# Altium project FMC_ADC_250M_16B_4ch_LNLS.PrjPCB (part 3 of 4)

## Sheet Clock_Distribution.SchDoc
size A3
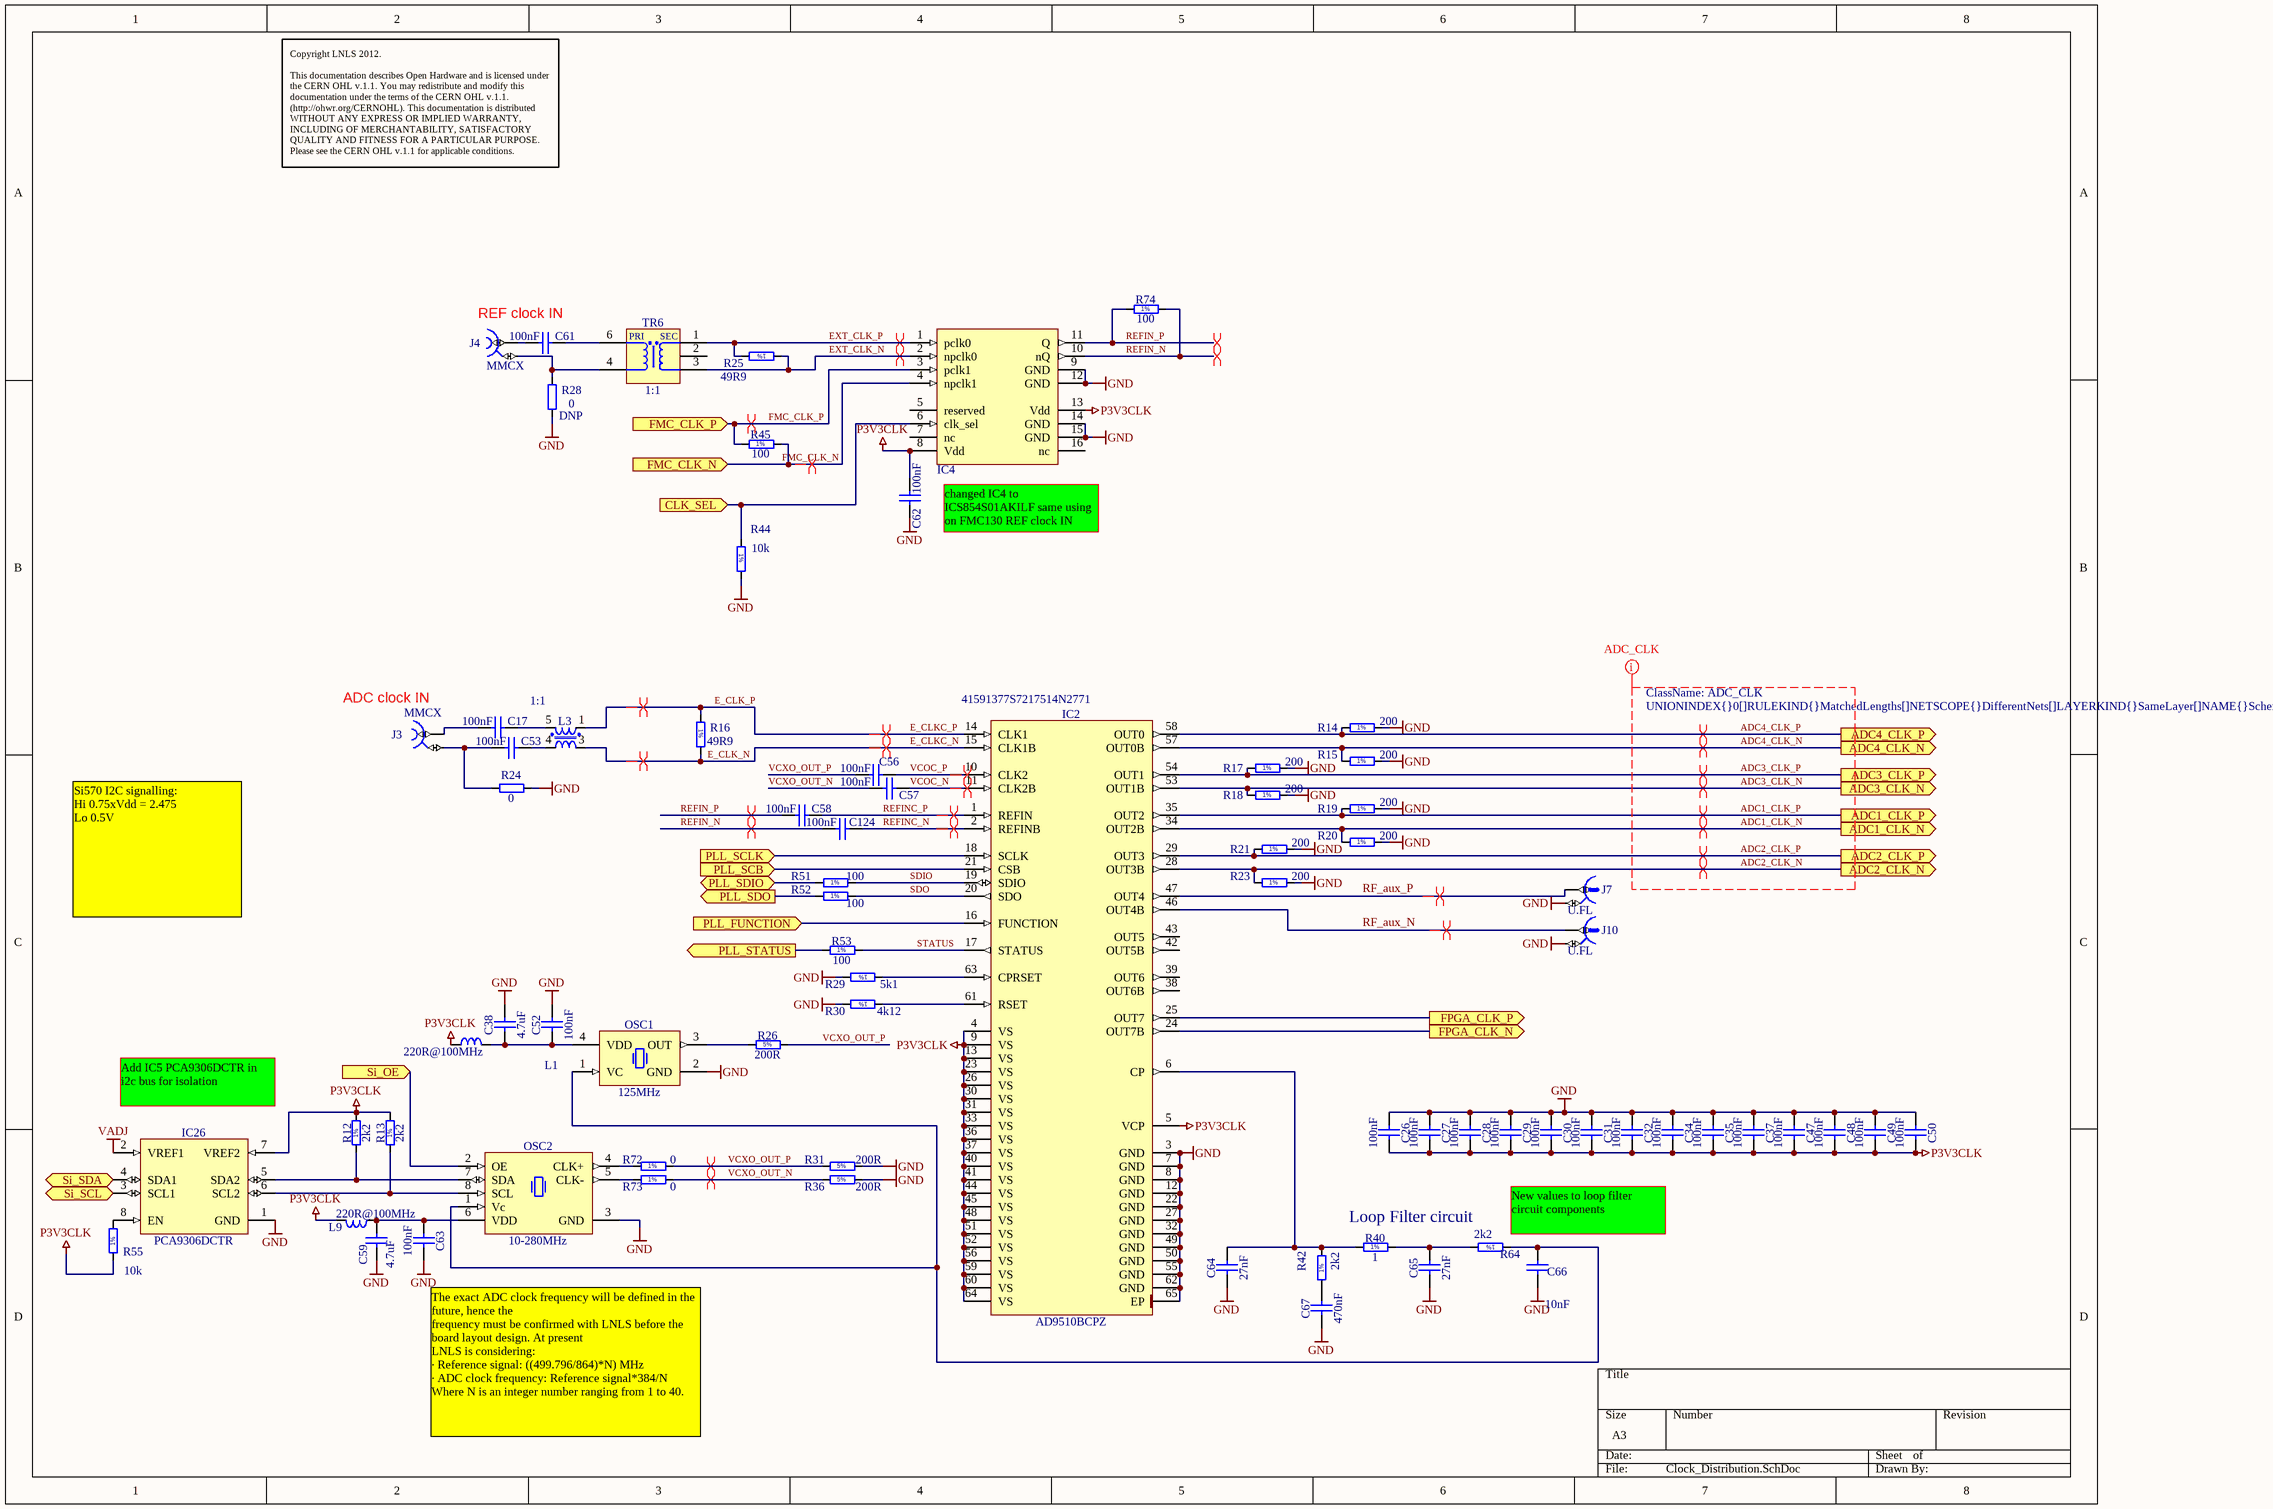
[diagram p5: Clock_Distribution.SchDoc]

### Parts
C17  100nF  [CAPC0603X33N]
C26  100nF  [CAPC0603X33N]
C27  100nF  [CAPC0603X33N]
C28  100nF  [CAPC0603X33N]
C29  100nF  [CAPC0603X33N]
C30  100nF  [CAPC0603X33N]
C31  100nF  [CAPC0603X33N]
C32  100nF  [CAPC0603X33N]
C34  100nF  [CAPC0603X33N]
C35  100nF  [CAPC0603X33N]
C37  100nF  [CAPC0603X33N]
C38  4.7uF  [CAPC1608X87N]
C47  100nF  [CAPC0603X33N]
C48  100nF  [CAPC0603X33N]
C49  100nF  [CAPC0603X33N]
C50  100nF  [CAPC0603X33N]
C52  100nF  [CAPC0603X33N]
C53  100nF  [CAPC0603X33N]
C56  100nF  [CAPC0603X33N]
C57  100nF  [CAPC0603X33N]
C58  100nF  [CAPC0603X33N]
C59  4.7uF  [CAPC1608X87N]
C61  100nF  [CAPC0603X33N]
C62  100nF  [CAPC0603X33N]
C63  100nF  [CAPC0603X33N]
C64  27nF  [CAPC1608X87N]
C65  27nF  [CAPC1608X87N]
C66  10nF  [CAPC0603X33N]
C67  470nF  [CAPC1608X87N]
C124  100nF  [CAPC0603X33N]
IC2  AD9510BCPZ  Supplier Part Number 1: 41591377S7217514N2771  [QFN50P900X900X100-65N-S485]
IC4  ICS854S01AKILF  [QFN50P300x300x100-17N-S140]  (value not drawn)
IC26  PCA9306DCTR  [SOP65P400X130-8N]
J3  Family: MMCX  [HUBER-SUHNER_85_MMCX-50-0-1/111 OH]  (hidden comment: Coax_1Female_1Shield)
J4  Family: MMCX  [HUBER-SUHNER_85_MMCX-50-0-1/111 OH]  (hidden comment: Coax_1Female_1Shield)
J7  U.FL  [HIROSE_U.FL-R-SMT-1(10)]
J10  U.FL  [HIROSE_U.FL-R-SMT-1(10)]
L1  220R@100MHz  [INDC1005X55N]
L3  1:1  [XFMR_MA-COM_SM-22 (H260)]
L9  220R@100MHz  [INDC1005X55N]
OSC1  125MHz  [OSC_CRYSTEK_CVHD-950]
OSC2  10-280MHz  [OSC_SILICON-LAB_SI571]
R12  2k2  [RESC1005X40N]
R13  2k2  [RESC1005X40N]
R14  200  [RESC1005X40N]
R15  200  [RESC1005X40N]
R16  49R9  [RESC1005X40N]
R17  200  [RESC1005X40N]
R18  200  [RESC1005X40N]
R19  200  [RESC1005X40N]
R20  200  [RESC1005X40N]
R21  200  [RESC1005X40N]
R23  200  [RESC1005X40N]
R24  0  [RESC1005X40N]
R25  49R9  [RESC1005X40N]
R26  200R  [RESC1005X40N]
R28  0  Mounted: DNP  [RESC1005X40N]
R29  5k1  [RESC1005X40N]
R30  4k12  [RESC1005X40N]
R31  200R  [RESC1005X40N]
R36  200R  [RESC1005X40N]
R40  1  [RESC1005X40N]
R42  2k2  [RESC1005X40N]
R44  10k  [RESC1005X40N]
R45  100  [RESC1005X40N]
R51  100  [RESC1005X40N]
R52  100  [RESC1005X40N]
R53  100  [RESC1005X40N]
R55  10k  [RESC1005X40N]
R64  2k2  [RESC1005X40N]
R72  0  [RESC1005X40N]
R73  0  [RESC1005X40N]
R74  100  [RESC1005X40N]
TR6  1:1  [XFMR_MINI-CIRCUITS_AT224-1]

### Ports
ADC1_CLK_N (out), ADC1_CLK_P (out), ADC2_CLK_N (out), ADC2_CLK_P (out), ADC3_CLK_N (out), ADC3_CLK_P (out), ADC4_CLK_N (out), ADC4_CLK_P (out), CLK_SEL (in), FMC_CLK_N (in), FMC_CLK_P (in), FPGA_CLK_N (out), FPGA_CLK_P (out), PLL_FUNCTION (in), PLL_SCB (in), PLL_SCLK (in), PLL_SDIO (bidir), PLL_SDO (out), PLL_STATUS (out), Si_OE (in), Si_SCL (in), Si_SDA (bidir)

### Nets
GND: C26.1 C27.1 C28.1 C29.1 C30.1 C31.1 C32.1 C34.1 C35.1 C37.1 C38.2 C47.1 C48.1 C49.1 C50.1 C52.2 C59.1 C62.1 C63.2 C64.1 C65.1 C66.1 C67.1 IC2.3(GND) IC2.7(GND) IC2.8(GND) IC2.12(GND) IC2.22(GND) IC2.27(GND) IC2.32(GND) IC2.49(GND) IC2.50(GND) IC2.55(GND) IC2.62(GND) IC2.65(EP) IC4.9(GND) IC4.12(GND) IC4.14(GND) IC4.15(GND) IC26.1(GND) J7.2 J10.2 OSC1.2(GND) OSC2.3(GND) R14.2 R15.2 R17.2 R18.2 R19.2 R20.2 R21.2 R23.2 R24.2 R28.2 R29.2 R30.2 R31.2 R36.2 R44.2
P3V3CLK: C26.2 C27.2 C28.2 C29.2 C30.2 C31.2 C32.2 C34.2 C35.2 C37.2 C47.2 C48.2 C49.2 C50.2 C62.2 IC2.4(VS) IC2.5(VCP) IC2.9(VS) IC2.13(VS) IC2.23(VS) IC2.26(VS) IC2.30(VS) IC2.31(VS) IC2.33(VS) IC2.36(VS) IC2.37(VS) IC2.40(VS) IC2.41(VS) IC2.44(VS) IC2.45(VS) IC2.48(VS) IC2.51(VS) IC2.52(VS) IC2.56(VS) IC2.59(VS) IC2.60(VS) IC2.64(VS) IC4.8(Vdd) IC4.13(Vdd) IC26.7(VREF2) L1.1 L9.2 R12.2 R13.2 R55.1
VADJ: IC26.2(VREF1)
ADC1_CLK_N: IC2.34(OUT2B) R20.1 ; port ADC1_CLK_N
ADC1_CLK_P: IC2.35(OUT2) R19.1 ; port ADC1_CLK_P
ADC2_CLK_N: IC2.28(OUT3B) R23.1 ; port ADC2_CLK_N
ADC2_CLK_P: IC2.29(OUT3) R21.1 ; port ADC2_CLK_P
ADC3_CLK_N: IC2.53(OUT1B) R18.1 ; port ADC3_CLK_N
ADC3_CLK_P: IC2.54(OUT1) R17.1 ; port ADC3_CLK_P
ADC4_CLK_N: IC2.57(OUT0B) R15.1 ; port ADC4_CLK_N
ADC4_CLK_P: IC2.58(OUT0) R14.1 ; port ADC4_CLK_P
CLK_SEL: IC4.6(clk_sel) R44.1 ; port CLK_SEL
E_CLK_N: IC2.15(CLK1B) L3.3 R16.2  [also labelled E_CLKC_N]
E_CLK_P: IC2.14(CLK1) L3.1 R16.1  [also labelled E_CLKC_P]
EXT_CLK_N: IC4.2(npclk0) R25.1 TR6.3(S)
EXT_CLK_P: IC4.1(pclk0) R25.2 TR6.1(SDOT)
FMC_CLK_N: IC4.4(npclk1) R45.2 ; port FMC_CLK_N
FMC_CLK_P: IC4.3(pclk1) R45.1 ; port FMC_CLK_P
FPGA_CLK_N: IC2.24(OUT7B) ; port FPGA_CLK_N
FPGA_CLK_P: IC2.25(OUT7) ; port FPGA_CLK_P
PLL_FUNCTION: IC2.16(FUNCTION) ; port PLL_FUNCTION
PLL_SCB: IC2.21(CSB) ; port PLL_SCB
PLL_SCLK: IC2.18(SCLK) ; port PLL_SCLK
PLL_SDIO: R51.1 ; port PLL_SDIO
PLL_SDO: R52.1 ; port PLL_SDO
PLL_STATUS: R53.1 ; port PLL_STATUS
REFIN_N: C124.2 IC4.10(nQ) R74.2
REFIN_P: C58.2 IC4.11(Q) R74.1
REFINC_N: C124.1 IC2.2(REFINB)
REFINC_P: C58.1 IC2.1(REFIN)
RF_aux_N: IC2.46(OUT4B) J10.1
RF_aux_P: IC2.47(OUT4) J7.1
SDIO: IC2.19(SDIO) R51.2
SDO: IC2.20(SDO) R52.2
Si_OE: OSC2.2(OE) ; port Si_OE
Si_SCL: IC26.3(SCL1) ; port Si_SCL
Si_SDA: IC26.4(SDA1) ; port Si_SDA
STATUS: IC2.17(STATUS) R53.2
VCOC_N: C57.1 IC2.11(CLK2B)
VCOC_P: C56.1 IC2.10(CLK2)
VCXO_OUT_N: C57.2 R36.1 R73.2
VCXO_OUT_P: C56.2 R26.2 R31.1 R72.2
NetC17_1: C17.1 L3.5
NetC17_2: C17.2 J3.1
NetC38_1: C38.1 C52.1 L1.2 OSC1.4(VDD)
NetC53_1: C53.1 L3.4
NetC53_2: C53.2 J3.2 R24.1
NetC59_2: C59.2 C63.1 L9.1 OSC2.6(VDD)
NetC61_1: C61.1 TR6.6(PDOT)
NetC61_2: C61.2 J4.1
NetC64_2: C64.2 IC2.6(CP) R40.1 R42.2
NetC65_2: C65.2 R40.2 R64.2
NetC66_2: C66.2 OSC1.1(VC) OSC2.1(Vc) R64.1
NetC67_2: C67.2 R42.1
NetIC2_61: IC2.61(RSET) R30.1
NetIC2_63: IC2.63(CPRSET) R29.1
NetIC26_5: IC26.5(SDA2) OSC2.7(SDA) R12.1
NetIC26_6: IC26.6(SCL2) OSC2.8(SCL) R13.1
NetIC26_8: IC26.8(EN) R55.2
NetJ4_2: J4.2 R28.1 TR6.4(P)
NetOSC1_3: OSC1.3(OUT) R26.1
NetOSC2_4: OSC2.4(CLK+) R72.1
NetOSC2_5: OSC2.5(CLK-) R73.1

Not connected (* = marked no-connect by the designer): IC2 38(OUT6B) 39(OUT6) 42(OUT5B) 43(OUT5); IC4 5(reserved) 7(nc) 16(nc); TR6 2(NU)

### Layout directives
differential pair: ADC1_CLK_N, ADC1_CLK_P, ADC2_CLK_N, ADC2_CLK_P, ADC3_CLK_N, ADC3_CLK_P, ADC4_CLK_N, ADC4_CLK_P, E_CLK_N, E_CLK_P, EXT_CLK_N, EXT_CLK_P, FMC_CLK_N, FMC_CLK_P, REFIN_N, REFIN_P, REFINC_N, REFINC_P, RF_aux_N, RF_aux_P, VCOC_N, VCOC_P, VCXO_OUT_N, VCXO_OUT_P
net class ADC_CLK; rule Matched Net Lengths [Tolerance = 3mm]: ADC1_CLK_N, ADC1_CLK_P, ADC2_CLK_N, ADC2_CLK_P, ADC3_CLK_N, ADC3_CLK_P, ADC4_CLK_N, ADC4_CLK_P

### Notes on the sheet
- Copyright LNLS 2012.
  This documentation describes Open Hardware and is licensed under the CERN OHL v.1.1. You may redistribute and modify this documentation under the terms of the CERN OHL v.1.1. (http://ohwr.org/CERNOHL). This documentation is distributed WITHOUT ANY EXPRESS OR IMPLIED WARRANTY, INCLUDING OF MERCHANTABILITY, SATISFACTORY QUALITY AND FITNESS FOR A PARTICULAR PURPOSE. Please see the CERN OHL v.1.1 for applicable conditions.
- REF clock IN
- changed IC4 to ICS854S01AKILF same using on FMC130 REF clock IN
- (near J3) ADC clock IN
- Si570 I2C signalling:
  Hi 0.75xVdd = 2.475
  Lo 0.5V
- (near IC26) Add IC5 PCA9306DCTR in i2c bus for isolation
- Loop Filter circuit
- New values to loop filter circuit components
- (near C63) The exact ADC clock frequency will be defined in the future, hence the
  frequency must be confirmed with LNLS before the board layout design. At present
  LNLS is considering:
  · Reference signal: ((499.796/864)*N) MHz
  · ADC clock frequency: Reference signal*384/N
  Where N is an integer number ranging from 1 to 40.
- (in symbol R0402_0R_JUMPER) 1%
- (in symbol R0402_1R_1%_0.0625W_200PPM) 1%
- (in symbol R0402_2K2_1%_0.0625W_100PPM) 1%
- (in symbol R0402_4K12_1%_0.0625W_100PPM) 1%
- (in symbol R0402_5K1_1%_0.0625W_100PPM) 1%
- (in symbol R0402_10K_1%_0.0625W_100PPM) 1%
- (in symbol R0402_49R9_1%_0.0625W_100PPM) 1%
- (in symbol R0402_100R_1%_0.0625W_100PPM) 1%
- (in symbol R0402_200R_1%_0.0625W_100PPM) 1%
- (in symbol XFMR_MINI-CIRCUITS_TC1-1+) PRI; SEC

### Library data of the parts
C17 C26-C32 C34 C35 C37 C47-C50 C52 C53 C56-C58 C61-C63 C124 = CC0201_100NF_6.3V_10%_X5R: Non-polarised capacitor; Part Description: SMD Multilayer Chip Ceramic Capacitor; Manufacturer: GENERIC; Manufacturer1 Part Number: 02016D104KAT2A; Voltage: 6.3V; TC: X5R; Tolerance: ±10%; Table: Capacitors SMD; Part Number: CC0201_100NF_6.3V_10%_X5R; Component Kind: Standard; Component Type: Standard; Pin Count: 2; Value: 100nF; Status: Not Recommended; Manufacturer Part Number: CC0201_100NF_6.3V_10%_X5R; Case: 0201; Mounted: Yes; Socket: No; SMD: Yes; Manufacturer1 Example: AVX; Manufacturer1 ComponentHeight: 0.33mm; HelpURL: \\cern.ch\dfs\Applications\Altium\Datasheets\CC0201_X5R_AVX.pdf; Author: CERN DEM JLC; CreateDate: 03/12/2007; LatestRevisionDate: 03/12/2007; Sense: No
C38 C59 = CC0603_4.7UF_6.3V_10%_X5R: Non-polarised capacitor; Part Description: SMD Multilayer Chip Ceramic Capacitor; Manufacturer: GENERIC; Manufacturer1 Part Number: 225520613672; Voltage: 6.3V; TC: X5R; Tolerance: ±10%; Table: Capacitors SMD; Part Number: CC0603_4.7UF_6.3V_10%_X5R; Component Kind: Standard; Component Type: Standard; Pin Count: 2; Value: 4.7uF; Status: Preferred; Manufacturer Part Number: CC0603_4.7uF_6.3V_10%_X5R; Case: 0603; Mounted: Yes; Socket: No; SMD: Yes; Manufacturer1 Example: PHYCOMP; Manufacturer1 ComponentHeight: 0.87mm; HelpURL: \\cern.ch\dfs\Applications\Altium\Datasheets\CC0805_X5R_PHYCOMP_HC.pdf; Author: CERN DEM JLC; CreateDate: 03/12/2007; LatestRevisionDate: 03/12/2007; Sense: No
C64 C65 = CC0603_27NF_25V_10%_X7R: Non-polarised capacitor; Part Description: SMD Multilayer Chip Ceramic Capacitor; Manufacturer: GENERIC; Manufacturer1 Part Number: 223891615642; Voltage: 25V; TC: X7R; Tolerance: ±10%; Table: Capacitors SMD; Part Number: CC0603_27NF_25V_10%_X7R; Component Kind: Standard; Component Type: Standard; Pin Count: 2; Value: 27nF; Status: Preferred; Manufacturer Part Number: CC0603_27NF_25V_10%_X7R; Case: 0603; Mounted: Yes; Socket: No; SMD: Yes; Manufacturer1 Example: PHYCOMP; Manufacturer1 ComponentHeight: 0.87mm; HelpURL: \\cern.ch\dfs\Applications\Altium\Datasheets\CC0603_X7R_PHYCOMP.pdf; Author: CERN DEM JLC; CreateDate: 03/12/2007; LatestRevisionDate: 03/12/2007; Sense: No
C66 = CC0201_10NF_10V_10%_X7R: Non-polarised capacitor; Part Description: SMD Multilayer Chip Ceramic Capacitor; Manufacturer: GENERIC; Manufacturer1 Part Number: GRM033R71A103KA01D; Voltage: 10V; TC: X7R; Tolerance: ±10%; Part Number: CC0201_10NF_10V_10%_X7R; Component Kind: Standard; Component Type: Standard; Pin Count: 2; Value: 10nF; Status: None; Manufacturer Part Number: CC0201_10NF_10V_10%_X7R; Case: 0201; Mounted: Yes; Socket: No; SMD: Yes; Manufacturer1 Example: Murata; Manufacturer1 ComponentHeight: 0.33mm; Author: LNLS DIG GBMB; CreateDate: 14/06/2016; LatestRevisionDate: 14/06/2016; Sense: No
C67 = CC0603_470NF_16V_10%_X5R: Non-polarised capacitor; Part Description: SMD Multilayer Chip Ceramic Capacitor; Manufacturer: GENERIC; Manufacturer1 Part Number: 223878613658; Voltage: 16V; TC: X5R; Tolerance: ±10%; Table: Capacitors SMD; Part Number: CC0603_470NF_16V_10%_X5R; Component Kind: Standard; Component Type: Standard; Pin Count: 2; Value: 470nF; Status: Preferred; Manufacturer Part Number: CC0603_470NF_16V_10%_X5R; Case: 0603; Mounted: Yes; Socket: No; SMD: Yes; Manufacturer1 Example: PHYCOMP; Manufacturer1 ComponentHeight: 0.87mm; HelpURL: \\cern.ch\dfs\Applications\Altium\Datasheets\CC0805_X5R_PHYCOMP_HC.pdf; Author: CERN DEM JLC; CreateDate: 03/12/2007; LatestRevisionDate: 03/12/2007; Sense: No
IC2 = AD9510BCPZ: 1.2 GHz Clock Distribution IC, PLL Core, Dividers, Delay Adjust, Eight Outputs; Manufacturer: ANALOG DEVICES; Table: Logic; Bonding: No; PressFit: No; Part Number: AD9510BCPZ; Component Kind: Standard; Component Type: Standard; Device: AD9510BCPZ; PackageDescription: QFN, 0.50mm Pitch, Square; 64 Pin, 9.00mm L X 9.00mm W X 1.00mm H Body (4.85 X 4.85mm Thermal Tab), IPC Medium Density; Part Description: 1.2 GHz Clock Distribution IC, PLL Core, Dividers, Delay Adjust, Eight Outputs; Manufacturer Part Number: AD9510BCPZ; Pin Count: 65; Case: QFN64; Mounted: Yes; Socket: No; SMD: Yes; ComponentHeight: 1mm; HelpURL: \\cern.ch\dfs\Applications\Altium\Datasheets\AD9510BCPZ.pdf; Author: CERN DEM JLC; CreateDate: 09/10/2012; LatestRevisionDate: 09/10/2012; Supplier 1: Arrow; Sense: No
IC4 = ICS854S01AKILF: 2:1 Differential-to-LVDS Multiplexer; Manufacturer: INTEGRATED DEVICE TECHNOLOGY (IDT); PressFit: No; Bonding: No; Manufacturer Part Number: ICS854S01AKILF; Part Number: ICS854S01AKILF; Component Kind: Standard; Component Type: Standard; Device: ICS854S01AKILF; PackageDescription: QFN, 0.50mm Pitch, Square; 16 Pin, 3.00mm L X 3.00mm W X 1.00mm H Body (w/Thermal Tab 1.00 X 1.80mm),  IPC Medium Density; Part Description: 2:1 Differential-to-LVDS Multiplexer; Pin Count: 16; Case: QFN16; Mounted: Yes; Socket: No; SMD: Yes; Sense: No; ComponentHeight: 1.0mm; Author: LNLS DIG GBMB; CreateDate: 03/06/2016; LatestRevisionDate: 03/06/2016
IC26 = PCA9306DCTR: Dual Bidirectional I2C Bus And SMBus Voltage-Level Translator; Manufacturer: TEXAS INSTRUMENTS; Table: Analog & Interface; Bonding: No; PressFit: No; Part Number: PCA9306DCTR; Component Kind: Standard; Component Type: Standard; Device: PCA9306DCTR; PackageDescription: SOP, 0.65mm, Pitch; 8 Pin, 2.80mm W X 2.95mm L X 1.30mm H Body, PC Medium Density; Part Description: Dual Bidirectional I2C Bus And SMBus Voltage-Level Translator; Manufacturer Part Number: PCA9306DCTR; Pin Count: 8; Case: SSOP8; Mounted: Yes; Socket: No; SMD: Yes; ComponentHeight: 1.3mm; Author: CERN DEM JLC; HelpURL: \\cern.ch\dfs\Applications\Altium\Datasheets\PCA9306DCTR.pdf; CreateDate: 25/02/2013; LatestRevisionDate: 11/02/2016; Sense: No
J3 J4 = HUBER-SUHNER_85_MMCX-50-0-1/111 OH: Part Description: MMCX 50 Ohms Right Angle PCB Jack; Manufacturer: HUBER+SUHNER; Table: Miscellaneous; Part Number: HUBER-SUHNER_85_MMCX-50-0-1/111 OH; Component Kind: Standard; Component Type: Standard; Pin Count: 2; Mounted: Yes; Socket: No; SMD: No; Status: None; Manufacturer Part Number: 85_MMCX-50-0-1/111 OH; ComponentHeight: 9.6mm; HelpURL: \\cern.ch\dfs\Applications\Altium\Datasheets\HUBER-SUHNER_85_MMCX-50-0-1-111 OH.pdf; Author: CERN DEM JLC; CreateDate: 2011-10-04; LatestRevisionDate: 2011-10-04
J7 J10 = HIROSE_U.FL-R-SMT-1(10): Part Description: Up to 6GHz Ultra Small Surface Mount Male Coaxial Connectors U.FL Series; Manufacturer: HIROSE (HRS); Table: Miscellaneous; PressFit: No; Part Number: HIROSE_U.FL-R-SMT-1(10); Component Kind: Standard; Component Type: Standard; Pin Count: 2; Family: U.FL; Mounted: Yes; Socket: No; SMD: Yes; Status: None; Manufacturer Part Number: U.FL-R-SMT-1(10); ComponentHeight: 1.25mm; HelpURL: \\cern.ch\dfs\Applications\Altium\Datasheets\HIROSE_U.FL-R-SMT-1(10).pdf; Author: CERN DEM JLC; CreateDate: 24/03/2010; LatestRevisionDate: 24/03/2010; Sense: No
L1 L9 = IND0402_MURATA_BLM15HB221SN1: Inductor; Part Description: SMD EMIFIL Suppression Chip Ferrite Bead; Manufacturer: MURATA; Power: 250mA; Resistance: 1R; Tolerance: ±25%; Table: Inductors SMD; Part Number: IND0402_MURATA_BLM15HB221SN1; Component Kind: Standard; Component Type: Standard; Pin Count: 2; Value: 220R@100MHz; Status: None; Manufacturer Part Number: BLM15HB221SN1; Case: 0402; Mounted: Yes; Socket: No; SMD: Yes; ComponentHeight: 0.55mm; HelpURL: \\cern.ch\dfs\Applications\Altium\Datasheets\IND0402_MURATA_BLM15H.pdf; Author: CERN DEM JLC; CreateDate: 23/06/2009; LatestRevisionDate: 23/06/2009; Sense: No
L3 = XFMR_MA-COM_MABA-007159-000000: MA-COM E-Serie RF 1:1 Transmission Line Ttransformer 4.5-3000MHz; Part Description: RF Transmission Line Ttransformer 4.5-3000MHz (E-Serie); Manufacturer: MA-COM TECHNOLOGY; Table: Transformers; Part Number: XFMR_MA-COM_MABA-007159-000000; Component Kind: Standard; Component Type: Standard; Pin Count: 5; Value: 1:1; Status: None; Manufacturer Part Number: MABA-007159-000000; Mounted: Yes; Socket: No; SMD: Yes; ComponentHeight: 2.6mm; HelpURL: \\cern.ch\dfs\Applications\Altium\Datasheets\XFMR_MA-COM_MABA-007159-000000.pdf; Author: CERN DEM JLC; CreateDate: 03/10/2012; LatestRevisionDate: 03/10/2012; Sense: No
OSC1 = OSC_125MHZ_CRYSTEK_CVHD-950-100.000: Oscillator 4 pins 1=VC 2=GND 3=OUT 4=VDD; Part Number: OSC_250MHZ_CRYSTEK_CVHD-940-250.000; Part Description: 3.3V, ±20ppm, 15pF, 0..70°C, CMOS Surface Mount Ultra-Low Noise Oscillator (CVHD-950 Series); Manufacturer: CRYSTEK CRYSTAL; Table: Crystals & Oscillators; Bonding: No; PressFit: No; Component Kind: Standard; Component Type: Standard; Footprint: OSC_CRYSTEK_CVHD-940; PackageDescription: Oscillator, 5.08mm Pitch; 4 Pin, 14.2mm L X 9.14mm W X 5.3mm H, CVHD-950 Serie; Value: 125MHz; Manufacturer Part Number: CVHD-950-100.000; Pin Count: 4; Mounted: Yes; Socket: No; SMD: Yes; ComponentHeight: 5.3mm; HelpURL: \\cern.ch\dfs\Applications\Altium\Datasheets\OSC_CRYSTEK_CVHD-950.pdf; Author: CERN DEM JLC; CreateDate: 09/10/2012; LatestRevisionDate: 09/10/2012; Sense: No
OSC2 = OSC_10-280MHZ_SILICON-LAB_Si571AJC000337DG: Any-Rate I2C Programmable XO Oscillator Si571 Serie; Part Description: 10-280MHz 3.3V ±20ppm LVPECL, I2C Programmable VCXO Oscillator Si571 Series; Manufacturer: SILICON LABS; Bonding: No; PressFit: No; Part Number: OSC_10-280MHZ_SILICON-LAB_Si571AJC000337DG; Component Kind: Standard; Component Type: Standard; PackageDescription: Oscillator Si571 Series, 8 pins, 5x7mm; Value: 10-280MHz; Manufacturer Part Number: Si571AJC000337DG; Pin Count: 8; Mounted: Yes; Socket: No; SMD: Yes; ComponentHeight: 1.85mm; HelpURL: \\cern.ch\dfs\Applications\Altium\Datasheets\OSC_SILICON-LAB_SI571.pdf; Author: CERN DEM JLC; CreateDate: 07/07/2014; LatestRevisionDate: 07/07/2014; Sense: No
R12 R13 R42 R64 = R0402_2K2_1%_0.0625W_100PPM: Resistor - 1%; Part Description: General Purpose Thick Film Chip Resistor; Manufacturer: GENERIC; Manufacturer1 Part Number: 232270672202L; TC: ±100ppm/°C; Table: Resistors SMD; Part Number: R0402_2K2_1%_0.0625W_100PPM; Component Kind: Standard; Component Type: Standard; Pin Count: 2; Value: 2k2; Status: Not recommended; Power: 0.0625W; Tolerance: ±1%; Manufacturer Part Number: R0402_2K2_1%_0.0625W_100PPM; Case: 0402; Mounted: Yes; Socket: No; SMD: Yes; Manufacturer1 Example: YAGEO PHYCOMP; Manufacturer1 ComponentHeight: 0.4mm; HelpURL: \\cern.ch\dfs\Applications\Altium\Datasheets\R0402_Phycomp_RC0402.pdf; Author: CERN DEM JLC; CreateDate: 03/12/2007; LatestRevisionDate: 17/10/2012; Sense: No
R14 R15 R17-R21 R23 = R0402_200R_1%_0.0625W_100PPM: Resistor - 1%; Part Description: General Purpose Thick Film Chip Resistor; Manufacturer: GENERIC; Manufacturer1 Part Number: 232270672001L; TC: ±100ppm/°C; Table: Resistors SMD; Part Number: R0402_200R_1%_0.0625W_100PPM; Component Kind: Standard; Component Type: Standard; Pin Count: 2; Value: 200; Status: Not recommended; Power: 0.0625W; Tolerance: ±1%; Manufacturer Part Number: R0402_200R_1%_0.0625W_100PPM; Case: 0402; Mounted: Yes; Socket: No; SMD: Yes; Manufacturer1 Example: YAGEO PHYCOMP; Manufacturer1 ComponentHeight: 0.4mm; HelpURL: \\cern.ch\dfs\Applications\Altium\Datasheets\R0402_Phycomp_RC0402.pdf; Author: CERN DEM JLC; CreateDate: 03/12/2007; LatestRevisionDate: 17/10/2012; Sense: No
R16 R25 = R0402_49R9_1%_0.0625W_100PPM: Resistor - 1%; Part Description: General Purpose Thick Film Chip Resistor; Manufacturer: GENERIC; Manufacturer1 Part Number: 232270674999L or RC0402FR-0749R9L; TC: ±100ppm/°C; Part Number: R0402_49R9_1%_0.0625W_100PPM; Component Kind: Standard; Component Type: Standard; Pin Count: 2; Value: 49R9; Status: Not recommended; Power: 0.0625W; Tolerance: ±1%; Manufacturer Part Number: R0402_49R9_1%_0.0625W_100PPM; Case: 0402; Mounted: Yes; Sense: No; Socket: No; SMD: Yes; Manufacturer1 Example: YAGEO PHYCOMP; Manufacturer1 ComponentHeight: 0.4mm; HelpURL: \\cern.ch\dfs\Applications\Altium\Datasheets\R0402_Phycomp_RC0402.pdf; Author: CERN DEM JLC; CreateDate: 24/10/2012; LatestRevisionDate: 24/10/2012
R24 = R0402_0R_JUMPER: Resistor; Part Description: 1A (0.05R Max DC Resistance) Zero Ohm Jumper; Manufacturer: GENERIC; Manufacturer1 Part Number: 232270591001L; Mounted: No; Part Number: R0402_0R_JUMPER; Component Kind: Standard; Component Type: Standard; Pin Count: 2; Value: 0; Status: Not recommended; Manufacturer Part Number: R0402_0R_JUMPER; Case: 0402; Sense: No; Socket: No; SMD: Yes; Manufacturer1 Example: YAGEO PHYCOMP; Manufacturer1 ComponentHeight: 0.4mm; HelpURL: \\cern.ch\dfs\Applications\Altium\Datasheets\R0402_Phycomp_RC0402.pdf; Author: CERN DEM JLC; CreateDate: 03/12/2007; LatestRevisionDate: 17/10/2012
R26 R31 R36 = R0402_200R_5%_0.0625W_100PPM: Resistor - 5%; Part Description: Surface Mount; Manufacturer: Generic; Manufacturer1 Part Number: Undefined; TC: ±100ppm/°C; Mounted: No; Part Number: R0402_200R_5%_0.0625W_100PPM; Component Kind: Standard; Component Type: Standard; Pin Count: 2; Value: 200R; Status: Preferred; Tolerance: 5%; Manufacturer Part Number: R0402_200R_5%_0.0625W_100PPM; Case: 0402; Sense: No; Socket: No; SMD: Yes; ComponentHeight: 0.35mm; Manufacturer1 Example: Undefined; Manufacturer1 ComponentHeight: Undefined; HelpURL: Undefined; Author: CERN DEM JLC; CreateDate: 03/12/2007; LatestRevisionDate: 13/03/2008
R28 = R0402_0R_JUMPER: Resistor; Part Description: 1A (0.05R Max DC Resistance) Zero Ohm Jumper; Manufacturer: GENERIC; Manufacturer1 Part Number: 232270591001L; Part Number: R0402_0R_JUMPER; Component Kind: Standard; Component Type: Standard; Pin Count: 2; Value: 0; Status: Not recommended; Manufacturer Part Number: R0402_0R_JUMPER; Case: 0402; Sense: No; Socket: No; SMD: Yes; Manufacturer1 Example: YAGEO PHYCOMP; Manufacturer1 ComponentHeight: 0.4mm; HelpURL: \\cern.ch\dfs\Applications\Altium\Datasheets\R0402_Phycomp_RC0402.pdf; Author: CERN DEM JLC; CreateDate: 03/12/2007; LatestRevisionDate: 17/10/2012
R29 = R0402_5K1_1%_0.0625W_100PPM: Resistor - 1%; Part Description: General Purpose Thick Film Chip Resistor; Manufacturer: GENERIC; Manufacturer1 Part Number: 232270675102L; TC: ±100ppm/°C; Part Number: R0402_5K1_1%_0.0625W_100PPM; Component Kind: Standard; Component Type: Standard; Pin Count: 2; Value: 5k1; Status: Not recommended; Power: 0.0625W; Tolerance: ±1%; Manufacturer Part Number: R0402_5K1_1%_0.0625W_100PPM; Case: 0402; Mounted: Yes; Sense: No; Socket: No; SMD: Yes; Manufacturer1 Example: YAGEO PHYCOMP; Manufacturer1 ComponentHeight: 0.4mm; HelpURL: \\cern.ch\dfs\Applications\Altium\Datasheets\R0402_Phycomp_RC0402.pdf; Author: CERN DEM JLC; CreateDate: 03/12/2007; LatestRevisionDate: 17/10/2012
R30 = R0402_4K12_1%_0.0625W_100PPM: Resistor - 1%; Part Description: General Purpose Thick Film Chip Resistor; Manufacturer: GENERIC; Manufacturer1 Part Number: 232270674122L or RC0402FR-074K12L; TC: ±100ppm/°C; Part Number: R0402_4K12_1%_0.0625W_100PPM; Component Kind: Standard; Component Type: Standard; Pin Count: 2; Value: 4k12; Status: Not recommended; Power: 0.0625W; Tolerance: ±1%; Manufacturer Part Number: R0402_4K12_1%_0.0625W_100PPM; Case: 0402; Mounted: Yes; Sense: No; Socket: No; SMD: Yes; Manufacturer1 Example: YAGEO PHYCOMP; Manufacturer1 ComponentHeight: 0.4mm; HelpURL: \\cern.ch\dfs\Applications\Altium\Datasheets\R0402_Phycomp_RC0402.pdf; Author: CERN DEM JLC; CreateDate: 24/10/2012; LatestRevisionDate: 24/10/2012
R40 = R0402_1R_1%_0.0625W_200PPM: Resistor - 1%; Part Description: General Purpose Thick Film Chip Resistor; Manufacturer: GENERIC; Manufacturer1 Part Number: 232270671008L; TC: ±200ppm/°C; Table: Resistors SMD; Part Number: R0402_1R_1%_0.0625W_200PPM; Component Kind: Standard; Component Type: Standard; Pin Count: 2; Value: 1; Status: Not recommended; Power: 0.0625W; Tolerance: ±1%; Manufacturer Part Number: R0402_1R_1%_0.0625W_200PPM; Case: 0402; Mounted: Yes; Socket: No; SMD: Yes; Manufacturer1 Example: YAGEO PHYCOMP; Manufacturer1 ComponentHeight: 0.4mm; HelpURL: \\cern.ch\dfs\Applications\Altium\Datasheets\R0402_Phycomp_RC0402.pdf; Author: CERN DEM JLC; CreateDate: 03/12/2007; LatestRevisionDate: 17/10/2012; Sense: No
R44 R55 = R0402_10K_1%_0.0625W_100PPM: Resistor - 1%; Part Description: General Purpose Thick Film Chip Resistor; Manufacturer: GENERIC; Manufacturer1 Part Number: 232270671003L; TC: ±100ppm/°C; LatestRevisionDate: 17/10/2012; Part Number: R0402_10K_1%_0.0625W_100PPM; Component Kind: Standard; Component Type: Standard; Pin Count: 2; Value: 10k; Status: Not recommended; Power: 0.0625W; Tolerance: ±1%; Manufacturer Part Number: R0402_10K_1%_0.0625W_100PPM; Case: 0402; Mounted: Yes; Sense: No; Socket: No; SMD: Yes; Manufacturer1 Example: YAGEO PHYCOMP; Manufacturer1 ComponentHeight: 0.4mm; HelpURL: \\cern.ch\dfs\Applications\Altium\Datasheets\R0402_Phycomp_RC0402.pdf; Author: CERN DEM JLC; CreateDate: 03/12/2007
R45 R74 = R0402_100R_1%_0.0625W_100PPM: Resistor - 1%; Part Description: General Purpose Thick Film Chip Resistor; Manufacturer: GENERIC; Manufacturer1 Part Number: 232270671001L; TC: ±100ppm/°C; Value: 100; LatestRevisionDate: 17/10/2012; Part Number: R0402_100R_1%_0.0625W_100PPM; Component Kind: Standard; Component Type: Standard; Pin Count: 2; Status: Not recommended; Power: 0.0625W; Tolerance: ±1%; Manufacturer Part Number: R0402_100R_1%_0.0625W_100PPM; Case: 0402; Mounted: Yes; Sense: No; Socket: No; SMD: Yes; Manufacturer1 Example: YAGEO PHYCOMP; Manufacturer1 ComponentHeight: 0.4mm; HelpURL: \\cern.ch\dfs\Applications\Altium\Datasheets\R0402_Phycomp_RC0402.pdf; Author: CERN DEM JLC; CreateDate: 03/12/2007
R51-R53 = R0402_100R_1%_0.0625W_100PPM: Resistor - 1%; Part Description: General Purpose Thick Film Chip Resistor; Manufacturer: GENERIC; Manufacturer1 Part Number: 232270671001L; TC: ±100ppm/°C; Table: Resistors SMD; Part Number: R0402_100R_1%_0.0625W_100PPM; Component Kind: Standard; Component Type: Standard; Pin Count: 2; Value: 100; Status: Not recommended; Power: 0.0625W; Tolerance: ±1%; Manufacturer Part Number: R0402_100R_1%_0.0625W_100PPM; Case: 0402; Mounted: Yes; Socket: No; SMD: Yes; Manufacturer1 Example: YAGEO PHYCOMP; Manufacturer1 ComponentHeight: 0.4mm; HelpURL: \\cern.ch\dfs\Applications\Altium\Datasheets\R0402_Phycomp_RC0402.pdf; Author: CERN DEM JLC; CreateDate: 03/12/2007; LatestRevisionDate: 17/10/2012; Sense: No
R72 R73 = R0402_0R_JUMPER: Resistor - 1%; Part Description: 1A (0.05R Max DC Resistance) Zero Ohm Jumper; Manufacturer: GENERIC; Manufacturer1 Part Number: 232270591001L; Table: Resistors SMD; Part Number: R0402_0R_JUMPER; Component Kind: Standard; Component Type: Standard; Pin Count: 2; Value: 0; Status: Not recommended; Manufacturer Part Number: R0402_0R_JUMPER; Case: 0402; Mounted: Yes; Socket: No; SMD: Yes; Manufacturer1 Example: YAGEO PHYCOMP; Manufacturer1 ComponentHeight: 0.4mm; HelpURL: \\cern.ch\dfs\Applications\Altium\Datasheets\R0402_Phycomp_RC0402.pdf; Author: CERN DEM JLC; CreateDate: 03/12/2007; LatestRevisionDate: 17/10/2012; Sense: No
TR6 = XFMR_MINI-CIRCUITS_TC1-1+: 50 Ohm  0.4 To 500MHz RF Transformers; Part Number: XFMR_MINI-CIRCUITS_TC1-1T+; Part Description: 50 Ohms 1.5 to 500 MHz RF Transformer; Manufacturer Part Number: TC1-1+; Component Kind: Standard; Component Type: Standard; Pin Count: 5; Value: 1:1; Status: None; Manufacturer: MINI-CIRCUITS; Mounted: Yes; Socket: No; SMD: Yes; ComponentHeight: 4.06mm; HelpURL: \\cern.ch\dfs\Applications\Altium\Datasheets\XFMR_MINI-CIRCUITS_TC1-1+.pdf; Author: CERN DEM JLC; CreateDate: 08/02/2010; LatestRevisionDate: 27/04/2010; Table: Transformers; Sense: No

## Sheet ADC_Buffers.SchDoc
size A3
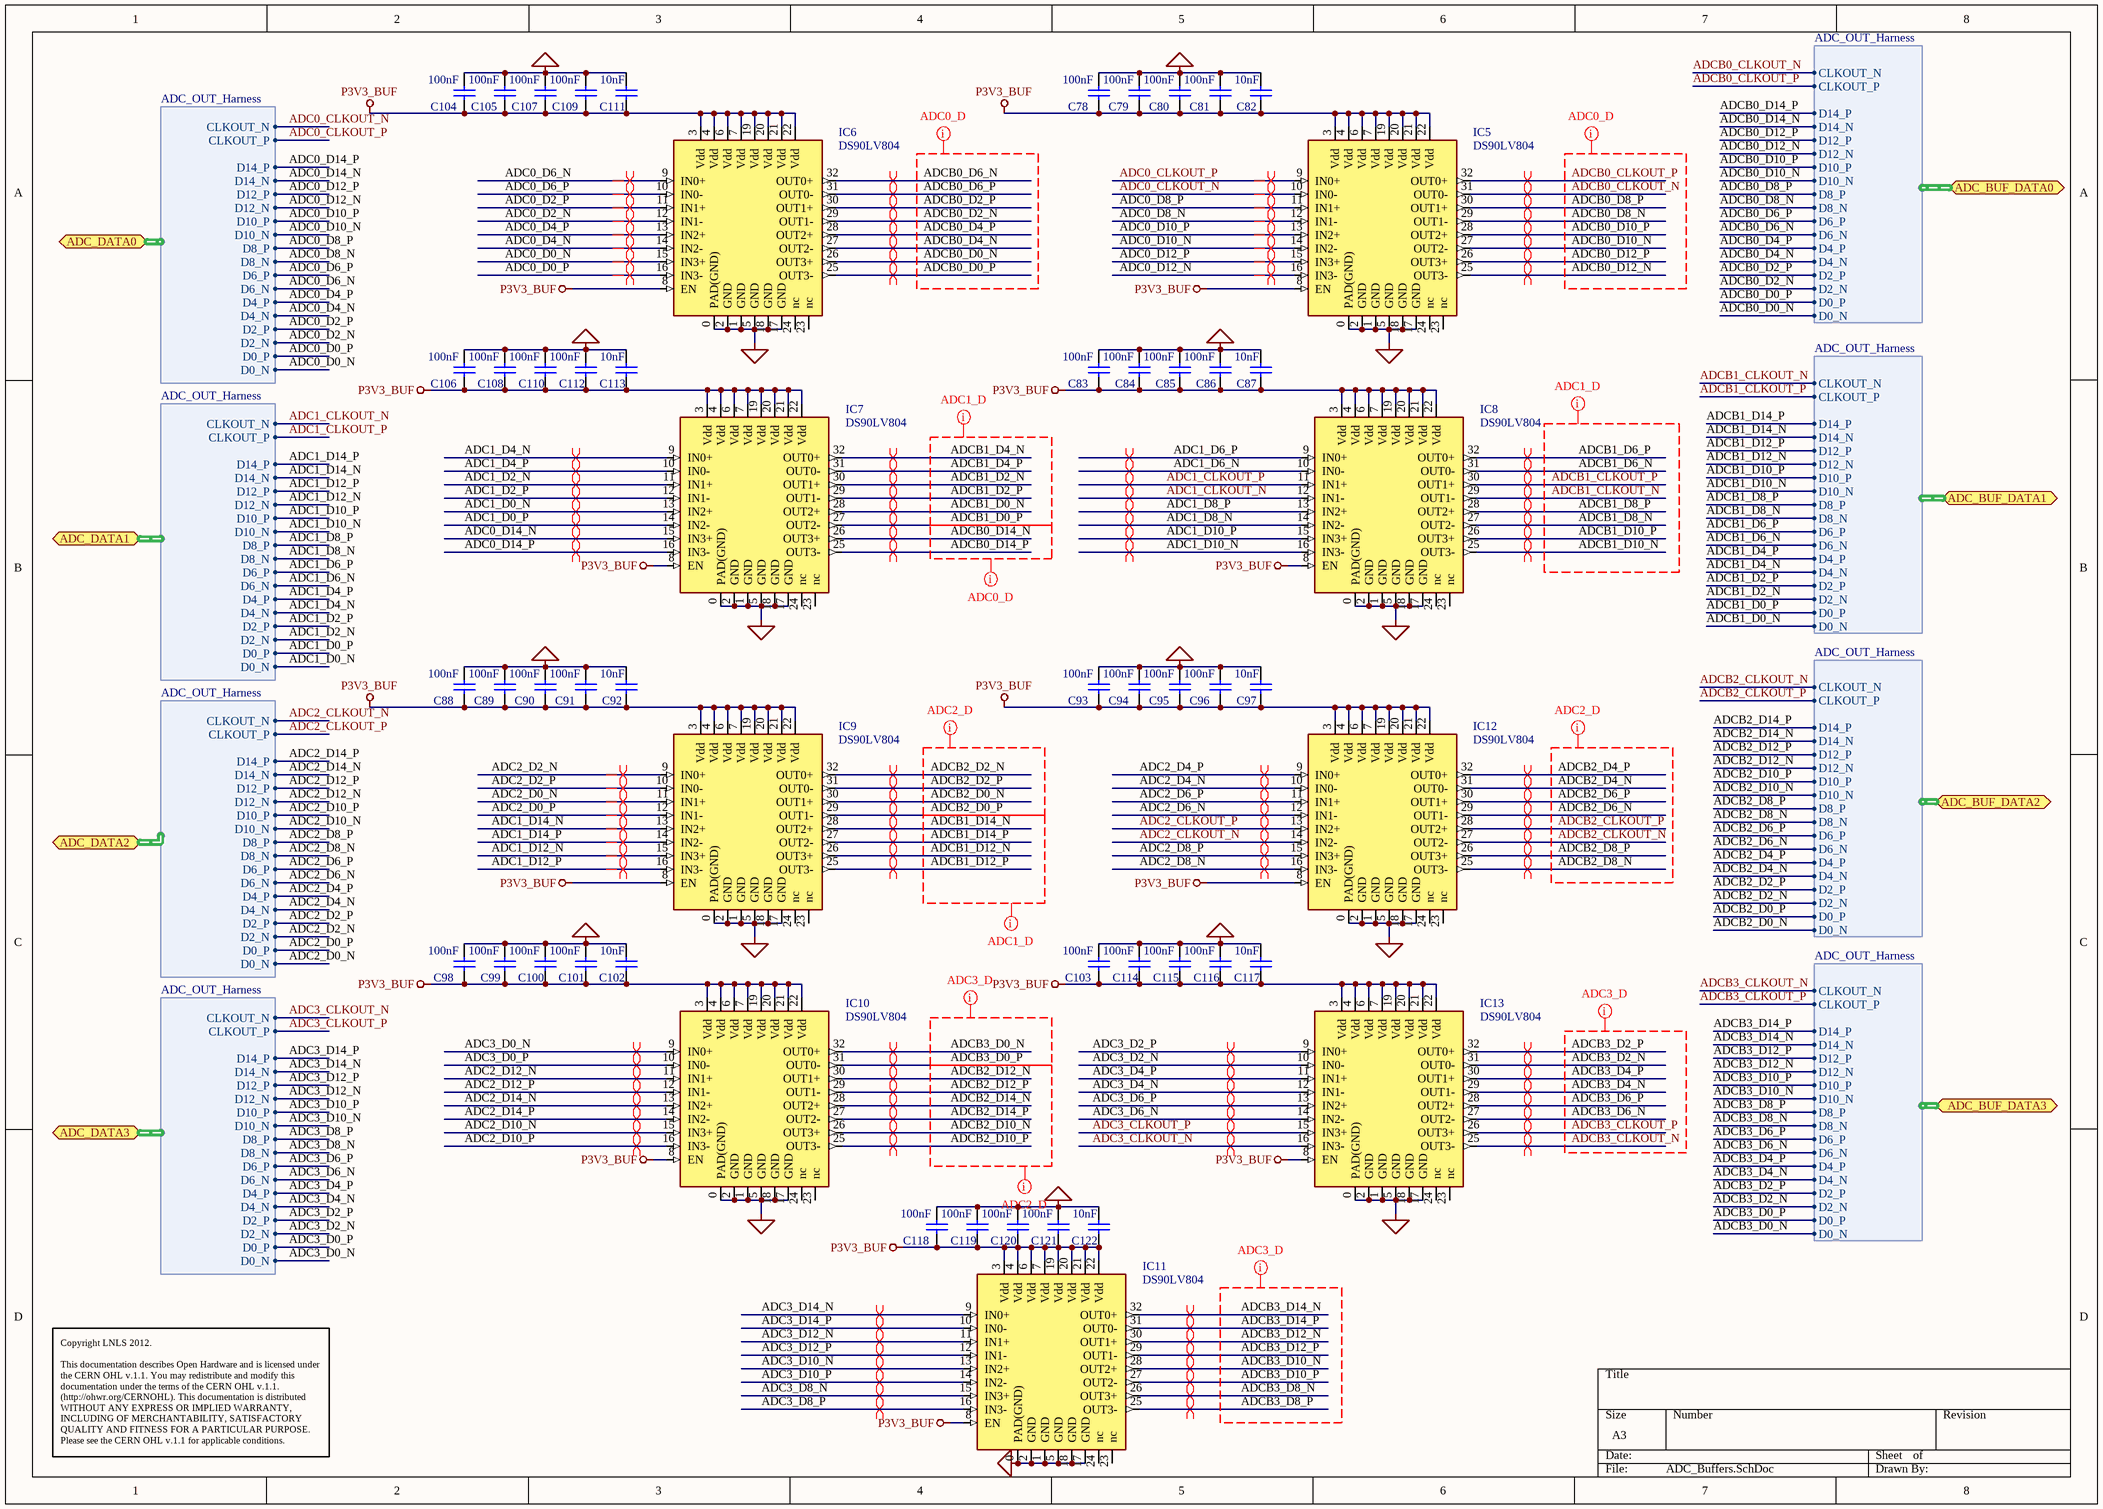
[diagram p6: ADC_Buffers.SchDoc]

### Parts
C78  100nF  [CAPC0603X33N]
C79  100nF  [CAPC0603X33N]
C80  100nF  [CAPC0603X33N]
C81  100nF  [CAPC0603X33N]
C82  10nF  [CAPC0603X33N]
C83  100nF  [CAPC0603X33N]
C84  100nF  [CAPC0603X33N]
C85  100nF  [CAPC0603X33N]
C86  100nF  [CAPC0603X33N]
C87  10nF  [CAPC0603X33N]
C88  100nF  [CAPC0603X33N]
C89  100nF  [CAPC0603X33N]
C90  100nF  [CAPC0603X33N]
C91  100nF  [CAPC0603X33N]
C92  10nF  [CAPC0603X33N]
C93  100nF  [CAPC0603X33N]
C94  100nF  [CAPC0603X33N]
C95  100nF  [CAPC0603X33N]
C96  100nF  [CAPC0603X33N]
C97  10nF  [CAPC0603X33N]
C98  100nF  [CAPC0603X33N]
C99  100nF  [CAPC0603X33N]
C100  100nF  [CAPC0603X33N]
C101  100nF  [CAPC0603X33N]
C102  10nF  [CAPC0603X33N]
C103  100nF  [CAPC0603X33N]
C104  100nF  [CAPC0603X33N]
C105  100nF  [CAPC0603X33N]
C106  100nF  [CAPC0603X33N]
C107  100nF  [CAPC0603X33N]
C108  100nF  [CAPC0603X33N]
C109  100nF  [CAPC0603X33N]
C110  100nF  [CAPC0603X33N]
C111  10nF  [CAPC0603X33N]
C112  100nF  [CAPC0603X33N]
C113  10nF  [CAPC0603X33N]
C114  100nF  [CAPC0603X33N]
C115  100nF  [CAPC0603X33N]
C116  100nF  [CAPC0603X33N]
C117  10nF  [CAPC0603X33N]
C118  100nF  [CAPC0603X33N]
C119  100nF  [CAPC0603X33N]
C120  100nF  [CAPC0603X33N]
C121  100nF  [CAPC0603X33N]
C122  10nF  [CAPC0603X33N]
IC5  DS90LV804  [QFN50P500X500X80-33N-S320]
IC6  DS90LV804  [QFN50P500X500X80-33N-S320]
IC7  DS90LV804  [LFCSP32]
IC8  DS90LV804  [LFCSP32]
IC9  DS90LV804  [LFCSP32]
IC10  DS90LV804  [LFCSP32]
IC11  DS90LV804  [LFCSP32]
IC12  DS90LV804  [LFCSP32]
IC13  DS90LV804  [LFCSP32]

### Ports
ADC_BUF_DATA0 (harness ADC_OUT_Harness), ADC_BUF_DATA1 (harness ADC_OUT_Harness), ADC_BUF_DATA2 (harness ADC_OUT_Harness), ADC_BUF_DATA3 (harness ADC_OUT_Harness), ADC_DATA0 (harness ADC_OUT_Harness), ADC_DATA1 (harness ADC_OUT_Harness), ADC_DATA2 (harness ADC_OUT_Harness), ADC_DATA3 (harness ADC_OUT_Harness)

### Harnesses
ADC_OUT_Harness: D14_P, D14_N, D12_P, D12_N, D10_P, D10_N, D8_P, D8_N, D6_P, D6_N, D4_P, D4_N, D2_P, D2_N, D0_P, D0_N, CLKOUT_N, CLKOUT_P

### Nets
GND: C78.1 C79.1 C80.1 C81.1 C82.1 C83.1 C84.1 C85.1 C86.1 C87.1 C88.1 C89.1 C90.1 C91.1 C92.1 C93.1 C94.1 C95.1 C96.1 C97.1 C98.1 C99.1 C100.1 C101.1 C102.1 C103.1 C104.1 C105.1 C106.1 C107.1 C108.1 C109.1 C110.1 C111.1 C112.1 C113.1 C114.1 C115.1 C116.1 C117.1 C118.1 C119.1 C120.1 C121.1 C122.1 IC5.0(PAD(GND)) IC5.1(GND) IC5.2(GND) IC5.5(GND) IC5.17(GND) IC5.18(GND) IC6.0(PAD(GND)) IC6.1(GND) IC6.2(GND) IC6.5(GND) IC6.17(GND) IC6.18(GND) IC7.0(PAD(GND)) IC7.1(GND) IC7.2(GND) IC7.5(GND) IC7.17(GND) IC7.18(GND) IC8.0(PAD(GND)) IC8.1(GND) IC8.2(GND) IC8.5(GND) IC8.17(GND) IC8.18(GND) IC9.0(PAD(GND)) IC9.1(GND) IC9.2(GND) IC9.5(GND) IC9.17(GND) IC9.18(GND) IC10.0(PAD(GND)) IC10.1(GND) IC10.2(GND) IC10.5(GND) IC10.17(GND) IC10.18(GND) IC11.0(PAD(GND)) IC11.1(GND) IC11.2(GND) IC11.5(GND) IC11.17(GND) IC11.18(GND) IC12.0(PAD(GND)) IC12.1(GND) IC12.2(GND) IC12.5(GND) IC12.17(GND) IC12.18(GND) IC13.0(PAD(GND)) IC13.1(GND) IC13.2(GND) IC13.5(GND) IC13.17(GND) IC13.18(GND)
P3V3_BUF: C78.2 C79.2 C80.2 C81.2 C82.2 C83.2 C84.2 C85.2 C86.2 C87.2 C88.2 C89.2 C90.2 C91.2 C92.2 C93.2 C94.2 C95.2 C96.2 C97.2 C98.2 C99.2 C100.2 C101.2 C102.2 C103.2 C104.2 C105.2 C106.2 C107.2 C108.2 C109.2 C110.2 C111.2 C112.2 C113.2 C114.2 C115.2 C116.2 C117.2 C118.2 C119.2 C120.2 C121.2 C122.2 IC5.3(Vdd) IC5.4(Vdd) IC5.6(Vdd) IC5.7(Vdd) IC5.8(EN) IC5.19(Vdd) IC5.20(Vdd) IC5.21(Vdd) IC5.22(Vdd) IC6.3(Vdd) IC6.4(Vdd) IC6.6(Vdd) IC6.7(Vdd) IC6.8(EN) IC6.19(Vdd) IC6.20(Vdd) IC6.21(Vdd) IC6.22(Vdd) IC7.3(Vdd) IC7.4(Vdd) IC7.6(Vdd) IC7.7(Vdd) IC7.8(EN) IC7.19(Vdd) IC7.20(Vdd) IC7.21(Vdd) IC7.22(Vdd) IC8.3(Vdd) IC8.4(Vdd) IC8.6(Vdd) IC8.7(Vdd) IC8.8(EN) IC8.19(Vdd) IC8.20(Vdd) IC8.21(Vdd) IC8.22(Vdd) IC9.3(Vdd) IC9.4(Vdd) IC9.6(Vdd) IC9.7(Vdd) IC9.8(EN) IC9.19(Vdd) IC9.20(Vdd) IC9.21(Vdd) IC9.22(Vdd) IC10.3(Vdd) IC10.4(Vdd) IC10.6(Vdd) IC10.7(Vdd) IC10.8(EN) IC10.19(Vdd) IC10.20(Vdd) IC10.21(Vdd) IC10.22(Vdd) IC11.3(Vdd) IC11.4(Vdd) IC11.6(Vdd) IC11.7(Vdd) IC11.8(EN) IC11.19(Vdd) IC11.20(Vdd) IC11.21(Vdd) IC11.22(Vdd) IC12.3(Vdd) IC12.4(Vdd) IC12.6(Vdd) IC12.7(Vdd) IC12.8(EN) IC12.19(Vdd) IC12.20(Vdd) IC12.21(Vdd) IC12.22(Vdd) IC13.3(Vdd) IC13.4(Vdd) IC13.6(Vdd) IC13.7(Vdd) IC13.8(EN) IC13.19(Vdd) IC13.20(Vdd) IC13.21(Vdd) IC13.22(Vdd)
ADC0_CLKOUT_N: IC5.10(IN0-) ; port ADC_DATA0.CLKOUT_N  [project net ADC_DATA0.CLKOUT_N]
ADC0_CLKOUT_P: IC5.9(IN0+) ; port ADC_DATA0.CLKOUT_P  [project net ADC_DATA0.CLKOUT_P]
ADC0_D0_N: IC6.15(IN3+) ; port ADC_DATA0.D0_N  [project net ADC_DATA0.D0_N]
ADC0_D0_P: IC6.16(IN3-) ; port ADC_DATA0.D0_P  [project net ADC_DATA0.D0_P]
ADC0_D2_N: IC6.12(IN1-) ; port ADC_DATA0.D2_N  [project net ADC_DATA0.D2_N]
ADC0_D2_P: IC6.11(IN1+) ; port ADC_DATA0.D2_P  [project net ADC_DATA0.D2_P]
ADC0_D4_N: IC6.14(IN2-) ; port ADC_DATA0.D4_N  [project net ADC_DATA0.D4_N]
ADC0_D4_P: IC6.13(IN2+) ; port ADC_DATA0.D4_P  [project net ADC_DATA0.D4_P]
ADC0_D6_N: IC6.9(IN0+) ; port ADC_DATA0.D6_N  [project net ADC_DATA0.D6_N]
ADC0_D6_P: IC6.10(IN0-) ; port ADC_DATA0.D6_P  [project net ADC_DATA0.D6_P]
ADC0_D8_N: IC5.12(IN1-) ; port ADC_DATA0.D8_N  [project net ADC_DATA0.D8_N]
ADC0_D8_P: IC5.11(IN1+) ; port ADC_DATA0.D8_P  [project net ADC_DATA0.D8_P]
ADC0_D10_N: IC5.14(IN2-) ; port ADC_DATA0.D10_N  [project net ADC_DATA0.D10_N]
ADC0_D10_P: IC5.13(IN2+) ; port ADC_DATA0.D10_P  [project net ADC_DATA0.D10_P]
ADC0_D12_N: IC5.16(IN3-) ; port ADC_DATA0.D12_N  [project net ADC_DATA0.D12_N]
ADC0_D12_P: IC5.15(IN3+) ; port ADC_DATA0.D12_P  [project net ADC_DATA0.D12_P]
ADC0_D14_N: IC7.15(IN3+) ; port ADC_DATA0.D14_N  [project net ADC_DATA0.D14_N]
ADC0_D14_P: IC7.16(IN3-) ; port ADC_DATA0.D14_P  [project net ADC_DATA0.D14_P]
ADC1_CLKOUT_N: IC8.12(IN1-) ; port ADC_DATA1.CLKOUT_N  [project net ADC_DATA1.CLKOUT_N]
ADC1_CLKOUT_P: IC8.11(IN1+) ; port ADC_DATA1.CLKOUT_P  [project net ADC_DATA1.CLKOUT_P]
ADC1_D0_N: IC7.13(IN2+) ; port ADC_DATA1.D0_N  [project net ADC_DATA1.D0_N]
ADC1_D0_P: IC7.14(IN2-) ; port ADC_DATA1.D0_P  [project net ADC_DATA1.D0_P]
ADC1_D2_N: IC7.11(IN1+) ; port ADC_DATA1.D2_N  [project net ADC_DATA1.D2_N]
ADC1_D2_P: IC7.12(IN1-) ; port ADC_DATA1.D2_P  [project net ADC_DATA1.D2_P]
ADC1_D4_N: IC7.9(IN0+) ; port ADC_DATA1.D4_N  [project net ADC_DATA1.D4_N]
ADC1_D4_P: IC7.10(IN0-) ; port ADC_DATA1.D4_P  [project net ADC_DATA1.D4_P]
ADC1_D6_N: IC8.10(IN0-) ; port ADC_DATA1.D6_N  [project net ADC_DATA1.D6_N]
ADC1_D6_P: IC8.9(IN0+) ; port ADC_DATA1.D6_P  [project net ADC_DATA1.D6_P]
ADC1_D8_N: IC8.14(IN2-) ; port ADC_DATA1.D8_N  [project net ADC_DATA1.D8_N]
ADC1_D8_P: IC8.13(IN2+) ; port ADC_DATA1.D8_P  [project net ADC_DATA1.D8_P]
ADC1_D10_N: IC8.16(IN3-) ; port ADC_DATA1.D10_N  [project net ADC_DATA1.D10_N]
ADC1_D10_P: IC8.15(IN3+) ; port ADC_DATA1.D10_P  [project net ADC_DATA1.D10_P]
ADC1_D12_N: IC9.15(IN3+) ; port ADC_DATA1.D12_N  [project net ADC_DATA1.D12_N]
ADC1_D12_P: IC9.16(IN3-) ; port ADC_DATA1.D12_P  [project net ADC_DATA1.D12_P]
ADC1_D14_N: IC9.13(IN2+) ; port ADC_DATA1.D14_N  [project net ADC_DATA1.D14_N]
ADC1_D14_P: IC9.14(IN2-) ; port ADC_DATA1.D14_P  [project net ADC_DATA1.D14_P]
ADC2_CLKOUT_N: IC12.14(IN2-) ; port ADC_DATA2.CLKOUT_N  [project net ADC_DATA2.CLKOUT_N]
ADC2_CLKOUT_P: IC12.13(IN2+) ; port ADC_DATA2.CLKOUT_P  [project net ADC_DATA2.CLKOUT_P]
ADC2_D0_N: IC9.11(IN1+) ; port ADC_DATA2.D0_N  [project net ADC_DATA2.D0_N]
ADC2_D0_P: IC9.12(IN1-) ; port ADC_DATA2.D0_P  [project net ADC_DATA2.D0_P]
ADC2_D2_N: IC9.9(IN0+) ; port ADC_DATA2.D2_N  [project net ADC_DATA2.D2_N]
ADC2_D2_P: IC9.10(IN0-) ; port ADC_DATA2.D2_P  [project net ADC_DATA2.D2_P]
ADC2_D4_N: IC12.10(IN0-) ; port ADC_DATA2.D4_N  [project net ADC_DATA2.D4_N]
ADC2_D4_P: IC12.9(IN0+) ; port ADC_DATA2.D4_P  [project net ADC_DATA2.D4_P]
ADC2_D6_N: IC12.12(IN1-) ; port ADC_DATA2.D6_N  [project net ADC_DATA2.D6_N]
ADC2_D6_P: IC12.11(IN1+) ; port ADC_DATA2.D6_P  [project net ADC_DATA2.D6_P]
ADC2_D8_N: IC12.16(IN3-) ; port ADC_DATA2.D8_N  [project net ADC_DATA2.D8_N]
ADC2_D8_P: IC12.15(IN3+) ; port ADC_DATA2.D8_P  [project net ADC_DATA2.D8_P]
ADC2_D10_N: IC10.15(IN3+) ; port ADC_DATA2.D10_N  [project net ADC_DATA2.D10_N]
ADC2_D10_P: IC10.16(IN3-) ; port ADC_DATA2.D10_P  [project net ADC_DATA2.D10_P]
ADC2_D12_N: IC10.11(IN1+) ; port ADC_DATA2.D12_N  [project net ADC_DATA2.D12_N]
ADC2_D12_P: IC10.12(IN1-) ; port ADC_DATA2.D12_P  [project net ADC_DATA2.D12_P]
ADC2_D14_N: IC10.13(IN2+) ; port ADC_DATA2.D14_N  [project net ADC_DATA2.D14_N]
ADC2_D14_P: IC10.14(IN2-) ; port ADC_DATA2.D14_P  [project net ADC_DATA2.D14_P]
ADC3_CLKOUT_N: IC13.16(IN3-) ; port ADC_DATA3.CLKOUT_N  [project net ADC_DATA3.CLKOUT_N]
ADC3_CLKOUT_P: IC13.15(IN3+) ; port ADC_DATA3.CLKOUT_P  [project net ADC_DATA3.CLKOUT_P]
ADC3_D0_N: IC10.9(IN0+) ; port ADC_DATA3.D0_N  [project net ADC_DATA3.D0_N]
ADC3_D0_P: IC10.10(IN0-) ; port ADC_DATA3.D0_P  [project net ADC_DATA3.D0_P]
ADC3_D2_N: IC13.10(IN0-) ; port ADC_DATA3.D2_N  [project net ADC_DATA3.D2_N]
ADC3_D2_P: IC13.9(IN0+) ; port ADC_DATA3.D2_P  [project net ADC_DATA3.D2_P]
ADC3_D4_N: IC13.12(IN1-) ; port ADC_DATA3.D4_N  [project net ADC_DATA3.D4_N]
ADC3_D4_P: IC13.11(IN1+) ; port ADC_DATA3.D4_P  [project net ADC_DATA3.D4_P]
ADC3_D6_N: IC13.14(IN2-) ; port ADC_DATA3.D6_N  [project net ADC_DATA3.D6_N]
ADC3_D6_P: IC13.13(IN2+) ; port ADC_DATA3.D6_P  [project net ADC_DATA3.D6_P]
ADC3_D8_N: IC11.15(IN3+) ; port ADC_DATA3.D8_N  [project net ADC_DATA3.D8_N]
ADC3_D8_P: IC11.16(IN3-) ; port ADC_DATA3.D8_P  [project net ADC_DATA3.D8_P]
ADC3_D10_N: IC11.13(IN2+) ; port ADC_DATA3.D10_N  [project net ADC_DATA3.D10_N]
ADC3_D10_P: IC11.14(IN2-) ; port ADC_DATA3.D10_P  [project net ADC_DATA3.D10_P]
ADC3_D12_N: IC11.11(IN1+) ; port ADC_DATA3.D12_N  [project net ADC_DATA3.D12_N]
ADC3_D12_P: IC11.12(IN1-) ; port ADC_DATA3.D12_P  [project net ADC_DATA3.D12_P]
ADC3_D14_N: IC11.9(IN0+) ; port ADC_DATA3.D14_N  [project net ADC_DATA3.D14_N]
ADC3_D14_P: IC11.10(IN0-) ; port ADC_DATA3.D14_P  [project net ADC_DATA3.D14_P]
ADCB0_CLKOUT_N: IC5.31(OUT0-) ; port ADC_BUF_DATA0.CLKOUT_N  [project net ADC_BUF_DATA0.CLKOUT_N]
ADCB0_CLKOUT_P: IC5.32(OUT0+) ; port ADC_BUF_DATA0.CLKOUT_P  [project net ADC_BUF_DATA0.CLKOUT_P]
ADCB0_D0_N: IC6.26(OUT3+) ; port ADC_BUF_DATA0.D0_N  [project net ADC_BUF_DATA0.D0_N]
ADCB0_D0_P: IC6.25(OUT3-) ; port ADC_BUF_DATA0.D0_P  [project net ADC_BUF_DATA0.D0_P]
ADCB0_D2_N: IC6.29(OUT1-) ; port ADC_BUF_DATA0.D2_N  [project net ADC_BUF_DATA0.D2_N]
ADCB0_D2_P: IC6.30(OUT1+) ; port ADC_BUF_DATA0.D2_P  [project net ADC_BUF_DATA0.D2_P]
ADCB0_D4_N: IC6.27(OUT2-) ; port ADC_BUF_DATA0.D4_N  [project net ADC_BUF_DATA0.D4_N]
ADCB0_D4_P: IC6.28(OUT2+) ; port ADC_BUF_DATA0.D4_P  [project net ADC_BUF_DATA0.D4_P]
ADCB0_D6_N: IC6.32(OUT0+) ; port ADC_BUF_DATA0.D6_N  [project net ADC_BUF_DATA0.D6_N]
ADCB0_D6_P: IC6.31(OUT0-) ; port ADC_BUF_DATA0.D6_P  [project net ADC_BUF_DATA0.D6_P]
ADCB0_D8_N: IC5.29(OUT1-) ; port ADC_BUF_DATA0.D8_N  [project net ADC_BUF_DATA0.D8_N]
ADCB0_D8_P: IC5.30(OUT1+) ; port ADC_BUF_DATA0.D8_P  [project net ADC_BUF_DATA0.D8_P]
ADCB0_D10_N: IC5.27(OUT2-) ; port ADC_BUF_DATA0.D10_N  [project net ADC_BUF_DATA0.D10_N]
ADCB0_D10_P: IC5.28(OUT2+) ; port ADC_BUF_DATA0.D10_P  [project net ADC_BUF_DATA0.D10_P]
ADCB0_D12_N: IC5.25(OUT3-) ; port ADC_BUF_DATA0.D12_N  [project net ADC_BUF_DATA0.D12_N]
ADCB0_D12_P: IC5.26(OUT3+) ; port ADC_BUF_DATA0.D12_P  [project net ADC_BUF_DATA0.D12_P]
ADCB0_D14_N: IC7.26(OUT3+) ; port ADC_BUF_DATA0.D14_N  [project net ADC_BUF_DATA0.D14_N]
ADCB0_D14_P: IC7.25(OUT3-) ; port ADC_BUF_DATA0.D14_P  [project net ADC_BUF_DATA0.D14_P]
ADCB1_CLKOUT_N: IC8.29(OUT1-) ; port ADC_BUF_DATA1.CLKOUT_N  [project net ADC_BUF_DATA1.CLKOUT_N]
ADCB1_CLKOUT_P: IC8.30(OUT1+) ; port ADC_BUF_DATA1.CLKOUT_P  [project net ADC_BUF_DATA1.CLKOUT_P]
ADCB1_D0_N: IC7.28(OUT2+) ; port ADC_BUF_DATA1.D0_N  [project net ADC_BUF_DATA1.D0_N]
ADCB1_D0_P: IC7.27(OUT2-) ; port ADC_BUF_DATA1.D0_P  [project net ADC_BUF_DATA1.D0_P]
ADCB1_D2_N: IC7.30(OUT1+) ; port ADC_BUF_DATA1.D2_N  [project net ADC_BUF_DATA1.D2_N]
ADCB1_D2_P: IC7.29(OUT1-) ; port ADC_BUF_DATA1.D2_P  [project net ADC_BUF_DATA1.D2_P]
ADCB1_D4_N: IC7.32(OUT0+) ; port ADC_BUF_DATA1.D4_N  [project net ADC_BUF_DATA1.D4_N]
ADCB1_D4_P: IC7.31(OUT0-) ; port ADC_BUF_DATA1.D4_P  [project net ADC_BUF_DATA1.D4_P]
ADCB1_D6_N: IC8.31(OUT0-) ; port ADC_BUF_DATA1.D6_N  [project net ADC_BUF_DATA1.D6_N]
ADCB1_D6_P: IC8.32(OUT0+) ; port ADC_BUF_DATA1.D6_P  [project net ADC_BUF_DATA1.D6_P]
ADCB1_D8_N: IC8.27(OUT2-) ; port ADC_BUF_DATA1.D8_N  [project net ADC_BUF_DATA1.D8_N]
ADCB1_D8_P: IC8.28(OUT2+) ; port ADC_BUF_DATA1.D8_P  [project net ADC_BUF_DATA1.D8_P]
ADCB1_D10_N: IC8.25(OUT3-) ; port ADC_BUF_DATA1.D10_N  [project net ADC_BUF_DATA1.D10_N]
ADCB1_D10_P: IC8.26(OUT3+) ; port ADC_BUF_DATA1.D10_P  [project net ADC_BUF_DATA1.D10_P]
ADCB1_D12_N: IC9.26(OUT3+) ; port ADC_BUF_DATA1.D12_N  [project net ADC_BUF_DATA1.D12_N]
ADCB1_D12_P: IC9.25(OUT3-) ; port ADC_BUF_DATA1.D12_P  [project net ADC_BUF_DATA1.D12_P]
ADCB1_D14_N: IC9.28(OUT2+) ; port ADC_BUF_DATA1.D14_N  [project net ADC_BUF_DATA1.D14_N]
ADCB1_D14_P: IC9.27(OUT2-) ; port ADC_BUF_DATA1.D14_P  [project net ADC_BUF_DATA1.D14_P]
ADCB2_CLKOUT_N: IC12.27(OUT2-) ; port ADC_BUF_DATA2.CLKOUT_N  [project net ADC_BUF_DATA2.CLKOUT_N]
ADCB2_CLKOUT_P: IC12.28(OUT2+) ; port ADC_BUF_DATA2.CLKOUT_P  [project net ADC_BUF_DATA2.CLKOUT_P]
ADCB2_D0_N: IC9.30(OUT1+) ; port ADC_BUF_DATA2.D0_N  [project net ADC_BUF_DATA2.D0_N]
ADCB2_D0_P: IC9.29(OUT1-) ; port ADC_BUF_DATA2.D0_P  [project net ADC_BUF_DATA2.D0_P]
ADCB2_D2_N: IC9.32(OUT0+) ; port ADC_BUF_DATA2.D2_N  [project net ADC_BUF_DATA2.D2_N]
ADCB2_D2_P: IC9.31(OUT0-) ; port ADC_BUF_DATA2.D2_P  [project net ADC_BUF_DATA2.D2_P]
ADCB2_D4_N: IC12.31(OUT0-) ; port ADC_BUF_DATA2.D4_N  [project net ADC_BUF_DATA2.D4_N]
ADCB2_D4_P: IC12.32(OUT0+) ; port ADC_BUF_DATA2.D4_P  [project net ADC_BUF_DATA2.D4_P]
ADCB2_D6_N: IC12.29(OUT1-) ; port ADC_BUF_DATA2.D6_N  [project net ADC_BUF_DATA2.D6_N]
ADCB2_D6_P: IC12.30(OUT1+) ; port ADC_BUF_DATA2.D6_P  [project net ADC_BUF_DATA2.D6_P]
ADCB2_D8_N: IC12.25(OUT3-) ; port ADC_BUF_DATA2.D8_N  [project net ADC_BUF_DATA2.D8_N]
ADCB2_D8_P: IC12.26(OUT3+) ; port ADC_BUF_DATA2.D8_P  [project net ADC_BUF_DATA2.D8_P]
ADCB2_D10_N: IC10.26(OUT3+) ; port ADC_BUF_DATA2.D10_N  [project net ADC_BUF_DATA2.D10_N]
ADCB2_D10_P: IC10.25(OUT3-) ; port ADC_BUF_DATA2.D10_P  [project net ADC_BUF_DATA2.D10_P]
ADCB2_D12_N: IC10.30(OUT1+) ; port ADC_BUF_DATA2.D12_N  [project net ADC_BUF_DATA2.D12_N]
ADCB2_D12_P: IC10.29(OUT1-) ; port ADC_BUF_DATA2.D12_P  [project net ADC_BUF_DATA2.D12_P]
ADCB2_D14_N: IC10.28(OUT2+) ; port ADC_BUF_DATA2.D14_N  [project net ADC_BUF_DATA2.D14_N]
ADCB2_D14_P: IC10.27(OUT2-) ; port ADC_BUF_DATA2.D14_P  [project net ADC_BUF_DATA2.D14_P]
ADCB3_CLKOUT_N: IC13.25(OUT3-) ; port ADC_BUF_DATA3.CLKOUT_N  [project net ADC_BUF_DATA3.CLKOUT_N]
ADCB3_CLKOUT_P: IC13.26(OUT3+) ; port ADC_BUF_DATA3.CLKOUT_P  [project net ADC_BUF_DATA3.CLKOUT_P]
ADCB3_D0_N: IC10.32(OUT0+) ; port ADC_BUF_DATA3.D0_N  [project net ADC_BUF_DATA3.D0_N]
ADCB3_D0_P: IC10.31(OUT0-) ; port ADC_BUF_DATA3.D0_P  [project net ADC_BUF_DATA3.D0_P]
ADCB3_D2_N: IC13.31(OUT0-) ; port ADC_BUF_DATA3.D2_N  [project net ADC_BUF_DATA3.D2_N]
ADCB3_D2_P: IC13.32(OUT0+) ; port ADC_BUF_DATA3.D2_P  [project net ADC_BUF_DATA3.D2_P]
ADCB3_D4_N: IC13.29(OUT1-) ; port ADC_BUF_DATA3.D4_N  [project net ADC_BUF_DATA3.D4_N]
ADCB3_D4_P: IC13.30(OUT1+) ; port ADC_BUF_DATA3.D4_P  [project net ADC_BUF_DATA3.D4_P]
ADCB3_D6_N: IC13.27(OUT2-) ; port ADC_BUF_DATA3.D6_N  [project net ADC_BUF_DATA3.D6_N]
ADCB3_D6_P: IC13.28(OUT2+) ; port ADC_BUF_DATA3.D6_P  [project net ADC_BUF_DATA3.D6_P]
ADCB3_D8_N: IC11.26(OUT3+) ; port ADC_BUF_DATA3.D8_N  [project net ADC_BUF_DATA3.D8_N]
ADCB3_D8_P: IC11.25(OUT3-) ; port ADC_BUF_DATA3.D8_P  [project net ADC_BUF_DATA3.D8_P]
ADCB3_D10_N: IC11.28(OUT2+) ; port ADC_BUF_DATA3.D10_N  [project net ADC_BUF_DATA3.D10_N]
ADCB3_D10_P: IC11.27(OUT2-) ; port ADC_BUF_DATA3.D10_P  [project net ADC_BUF_DATA3.D10_P]
ADCB3_D12_N: IC11.30(OUT1+) ; port ADC_BUF_DATA3.D12_N  [project net ADC_BUF_DATA3.D12_N]
ADCB3_D12_P: IC11.29(OUT1-) ; port ADC_BUF_DATA3.D12_P  [project net ADC_BUF_DATA3.D12_P]
ADCB3_D14_N: IC11.32(OUT0+) ; port ADC_BUF_DATA3.D14_N  [project net ADC_BUF_DATA3.D14_N]
ADCB3_D14_P: IC11.31(OUT0-) ; port ADC_BUF_DATA3.D14_P  [project net ADC_BUF_DATA3.D14_P]

Not connected (* = marked no-connect by the designer): IC5 23(nc) 24(nc); IC6 23(nc) 24(nc); IC7 23(nc) 24(nc); IC8 23(nc) 24(nc); IC9 23(nc) 24(nc); IC10 23(nc) 24(nc); IC11 23(nc) 24(nc); IC12 23(nc) 24(nc); IC13 23(nc) 24(nc)

### Layout directives
differential pair: ADC_BUF_DATA0.CLKOUT_N, ADC_BUF_DATA0.CLKOUT_P, ADC_BUF_DATA0.D0_N, ADC_BUF_DATA0.D0_P, ADC_BUF_DATA0.D2_N, ADC_BUF_DATA0.D2_P, ADC_BUF_DATA0.D4_N, ADC_BUF_DATA0.D4_P, ADC_BUF_DATA0.D6_N, ADC_BUF_DATA0.D6_P, ADC_BUF_DATA0.D8_N, ADC_BUF_DATA0.D8_P, ADC_BUF_DATA0.D10_N, ADC_BUF_DATA0.D10_P, ADC_BUF_DATA0.D12_N, ADC_BUF_DATA0.D12_P, ADC_BUF_DATA0.D14_N, ADC_BUF_DATA0.D14_P, ADC_BUF_DATA1.CLKOUT_N, ADC_BUF_DATA1.CLKOUT_P, ADC_BUF_DATA1.D0_N, ADC_BUF_DATA1.D0_P, ADC_BUF_DATA1.D2_N, ADC_BUF_DATA1.D2_P, ADC_BUF_DATA1.D4_N, ADC_BUF_DATA1.D4_P, ADC_BUF_DATA1.D6_N, ADC_BUF_DATA1.D6_P, ADC_BUF_DATA1.D8_N, ADC_BUF_DATA1.D8_P, ADC_BUF_DATA1.D10_N, ADC_BUF_DATA1.D10_P, ADC_BUF_DATA1.D12_N, ADC_BUF_DATA1.D12_P, ADC_BUF_DATA1.D14_N, ADC_BUF_DATA1.D14_P, ADC_BUF_DATA2.CLKOUT_N, ADC_BUF_DATA2.CLKOUT_P, ADC_BUF_DATA2.D0_N, ADC_BUF_DATA2.D0_P, ADC_BUF_DATA2.D2_N, ADC_BUF_DATA2.D2_P, ADC_BUF_DATA2.D4_N, ADC_BUF_DATA2.D4_P, ADC_BUF_DATA2.D6_N, ADC_BUF_DATA2.D6_P, ADC_BUF_DATA2.D8_N, ADC_BUF_DATA2.D8_P, ADC_BUF_DATA2.D10_N, ADC_BUF_DATA2.D10_P, ADC_BUF_DATA2.D12_N, ADC_BUF_DATA2.D12_P, ADC_BUF_DATA2.D14_N, ADC_BUF_DATA2.D14_P, ADC_BUF_DATA3.CLKOUT_N, ADC_BUF_DATA3.CLKOUT_P, ADC_BUF_DATA3.D0_N, ADC_BUF_DATA3.D0_P, ADC_BUF_DATA3.D2_N, ADC_BUF_DATA3.D2_P, ADC_BUF_DATA3.D4_N, ADC_BUF_DATA3.D4_P, ADC_BUF_DATA3.D6_N, ADC_BUF_DATA3.D6_P, ADC_BUF_DATA3.D8_N, ADC_BUF_DATA3.D8_P, ADC_BUF_DATA3.D10_N, ADC_BUF_DATA3.D10_P, ADC_BUF_DATA3.D12_N, ADC_BUF_DATA3.D12_P, ADC_BUF_DATA3.D14_N, ADC_BUF_DATA3.D14_P, ADC_DATA0.CLKOUT_N, ADC_DATA0.CLKOUT_P, ADC_DATA0.D0_N, ADC_DATA0.D0_P, ADC_DATA0.D2_N, ADC_DATA0.D2_P, ADC_DATA0.D4_N, ADC_DATA0.D4_P, ADC_DATA0.D6_N, ADC_DATA0.D6_P, ADC_DATA0.D8_N, ADC_DATA0.D8_P, ADC_DATA0.D10_N, ADC_DATA0.D10_P, ADC_DATA0.D12_N, ADC_DATA0.D12_P, ADC_DATA0.D14_N, ADC_DATA0.D14_P, ADC_DATA1.CLKOUT_N, ADC_DATA1.CLKOUT_P, ADC_DATA1.D0_N, ADC_DATA1.D0_P, ADC_DATA1.D2_N, ADC_DATA1.D2_P, ADC_DATA1.D4_N, ADC_DATA1.D4_P, ADC_DATA1.D6_N, ADC_DATA1.D6_P, ADC_DATA1.D8_N, ADC_DATA1.D8_P, ADC_DATA1.D10_N, ADC_DATA1.D10_P, ADC_DATA1.D12_N, ADC_DATA1.D12_P, ADC_DATA1.D14_N, ADC_DATA1.D14_P, ADC_DATA2.CLKOUT_N, ADC_DATA2.CLKOUT_P, ADC_DATA2.D0_N, ADC_DATA2.D0_P, ADC_DATA2.D2_N, ADC_DATA2.D2_P, ADC_DATA2.D4_N, ADC_DATA2.D4_P, ADC_DATA2.D6_N, ADC_DATA2.D6_P, ADC_DATA2.D8_N, ADC_DATA2.D8_P, ADC_DATA2.D10_N, ADC_DATA2.D10_P, ADC_DATA2.D12_N, ADC_DATA2.D12_P, ADC_DATA2.D14_N, ADC_DATA2.D14_P, ADC_DATA3.CLKOUT_N, ADC_DATA3.CLKOUT_P, ADC_DATA3.D0_N, ADC_DATA3.D0_P, ADC_DATA3.D2_N, ADC_DATA3.D2_P, ADC_DATA3.D4_N, ADC_DATA3.D4_P, ADC_DATA3.D6_N, ADC_DATA3.D6_P, ADC_DATA3.D8_N, ADC_DATA3.D8_P, ADC_DATA3.D10_N, ADC_DATA3.D10_P, ADC_DATA3.D12_N, ADC_DATA3.D12_P, ADC_DATA3.D14_N, ADC_DATA3.D14_P
net class ADC2_D: ADCB2_CLKOUT_N, ADCB2_CLKOUT_P, ADCB2_D0_N, ADCB2_D0_P, ADCB2_D2_N, ADCB2_D2_P, ADCB2_D4_N, ADCB2_D4_P, ADCB2_D6_N, ADCB2_D6_P, ADCB2_D8_N, ADCB2_D8_P, ADCB2_D10_N, ADCB2_D10_P, ADCB2_D12_N, ADCB2_D12_P, ADCB2_D14_N, ADCB2_D14_P, ADCB3_D0_P
net class ADC0_D: ADCB0_CLKOUT_N, ADCB0_CLKOUT_P, ADCB0_D0_N, ADCB0_D0_P, ADCB0_D2_N, ADCB0_D2_P, ADCB0_D4_N, ADCB0_D4_P, ADCB0_D6_N, ADCB0_D6_P, ADCB0_D8_N, ADCB0_D8_P, ADCB0_D10_N, ADCB0_D10_P, ADCB0_D12_N, ADCB0_D12_P, ADCB0_D14_N, ADCB0_D14_P, ADCB1_D0_P
net class ADC1_D: ADCB1_CLKOUT_N, ADCB1_CLKOUT_P, ADCB1_D0_N, ADCB1_D0_P, ADCB1_D2_N, ADCB1_D2_P, ADCB1_D4_N, ADCB1_D4_P, ADCB1_D6_N, ADCB1_D6_P, ADCB1_D8_N, ADCB1_D8_P, ADCB1_D10_N, ADCB1_D10_P, ADCB1_D12_N, ADCB1_D12_P, ADCB1_D14_N, ADCB1_D14_P, ADCB2_D0_P
net class ADC3_D: ADCB3_CLKOUT_N, ADCB3_CLKOUT_P, ADCB3_D0_N, ADCB3_D0_P, ADCB3_D2_N, ADCB3_D2_P, ADCB3_D4_N, ADCB3_D4_P, ADCB3_D6_N, ADCB3_D6_P, ADCB3_D8_N, ADCB3_D8_P, ADCB3_D10_N, ADCB3_D10_P, ADCB3_D12_N, ADCB3_D12_P, ADCB3_D14_N, ADCB3_D14_P

### Notes on the sheet
- Copyright LNLS 2012.
  This documentation describes Open Hardware and is licensed under the CERN OHL v.1.1. You may redistribute and modify this documentation under the terms of the CERN OHL v.1.1. (http://ohwr.org/CERNOHL). This documentation is distributed WITHOUT ANY EXPRESS OR IMPLIED WARRANTY, INCLUDING OF MERCHANTABILITY, SATISFACTORY QUALITY AND FITNESS FOR A PARTICULAR PURPOSE. Please see the CERN OHL v.1.1 for applicable conditions.

### Library data of the parts
C78-C81 C83-C86 C88-C91 C93-C96 C98-C101 C103-C110 C112 C114-C116 C118-C121 = CC0201_100NF_6.3V_10%_X5R: as C17 on sheet Clock_Distribution; Value: 100nF; Part Number: CC0201_100NF_6.3V_10%_X5R; Component Kind: Standard; Component Type: Standard; Pin Count: 2; Status: Not Recommended; Manufacturer Part Number: CC0201_100NF_6.3V_10%_X5R; Case: 0201; Mounted: Yes; Socket: No; SMD: Yes; Manufacturer1 Example: AVX; Manufacturer1 ComponentHeight: 0.33mm; HelpURL: \\cern.ch\dfs\Applications\Altium\Datasheets\CC0201_X5R_AVX.pdf; Author: CERN DEM JLC; CreateDate: 03/12/2007; LatestRevisionDate: 03/12/2007; Sense: No
C82 C87 C92 C97 C102 C111 C113 C117 C122 = CC0201_10NF_10V_10%_X5R: Non-polarised capacitor; Part Description: SMD Multilayer Chip Ceramic Capacitor; Manufacturer: GENERIC; Manufacturer1 Part Number: 0201ZD103KAT2A; Voltage: 10V; TC: X5R; Tolerance: ±10%; Table: Capacitors SMD; Value: 10nF; Part Number: CC0201_10NF_10V_10%_X5R; Component Kind: Standard; Component Type: Standard; Pin Count: 2; Status: Not Recommended; Manufacturer Part Number: CC0201_10NF_10V_10%_X5R; Case: 0201; Mounted: Yes; Socket: No; SMD: Yes; Manufacturer1 Example: AVX; Manufacturer1 ComponentHeight: 0.33mm; HelpURL: \\cern.ch\dfs\Applications\Altium\Datasheets\CC0201_X5R_AVX.pdf; Author: CERN DEM JLC; CreateDate: 03/12/2007; LatestRevisionDate: 03/12/2007; Sense: No
IC5-IC13 = DS90LV804TSQ: 4-Channel 800 Mbps LVDS Buffer/Repeater; Manufacturer: TEXAS INSTRUMENTS; Bonding: No; PressFit: No; Part Number: DS90LV804TSQ; Author: LNLS DIG GBMB; Case: QFN32; ComponentHeight: 0.8mm; Component Type: Standard; CreateDate: 01/06/2016; Device: DS90LV804; LatestRevisionDate: 01/06/2016; Manufacturer Part Number: DS90LV804TSQ; Mounted: Yes; PackageDescription: QFN, 0.50mm Pitch, Square; 8 Pin X 8 Pin, 5mm X 5mm X 0.8mm H Body (w/Thermal Tab 3.2 X 3.2mm),  IPC Medium Density; Part Description: 4-Channel 800Mbps LVDS Buffer/Repeater; Pin Count: 33; Sense: No; SMD: Yes; Socket: No; Component Kind: Standard
  IC7-IC13: Footprint: QFN50P500X500X80-33N-S320